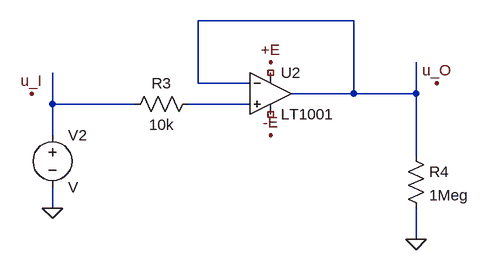
[diagram p0: schematic Draft1.asc]
Draft1.asc, the LTspice schematic file:
Version 4
SHEET 1 880 680
WIRE 208 -624 -32 -624
WIRE -32 -528 -32 -624
WIRE 48 -528 -32 -528
WIRE 208 -512 208 -624
WIRE 208 -512 112 -512
WIRE 304 -512 304 -560
WIRE 304 -512 208 -512
WIRE -256 -496 -256 -544
WIRE -128 -496 -256 -496
WIRE 48 -496 -48 -496
WIRE -256 -448 -256 -496
WIRE 304 -416 304 -512
WIRE -256 -336 -256 -368
WIRE 304 -288 304 -336
FLAG -256 -336 0
FLAG 304 -288 0
FLAG -288 -512 u_I
FLAG 336 -528 u_O
FLAG 80 -448 -E
FLAG 80 -560 +E
SYMBOL OpAmps\\LT1001 80 -576 R0
SYMATTR InstName U2
SYMBOL res -32 -512 R90
WINDOW 0 0 56 VBottom 2
WINDOW 3 32 56 VTop 2
SYMATTR InstName R3
SYMATTR Value 10k
SYMBOL voltage -256 -464 R0
SYMATTR InstName V2
SYMBOL res 288 -432 R0
SYMATTR InstName R4
SYMATTR Value 1Meg

The netlist it stands for:
* Draft1.asc
XU2 N003 N001 NC_01 NC_02 N001 LT1001  ; pins In+ In- V+ V- OUT
R3 N003 N002 10k
V2 N002 0 V
R4 N001 0 1Meg
.lib LTC.lib
.backanno
.end